# EAGLE design GPIO_adaptator (EAGLE 6.3)
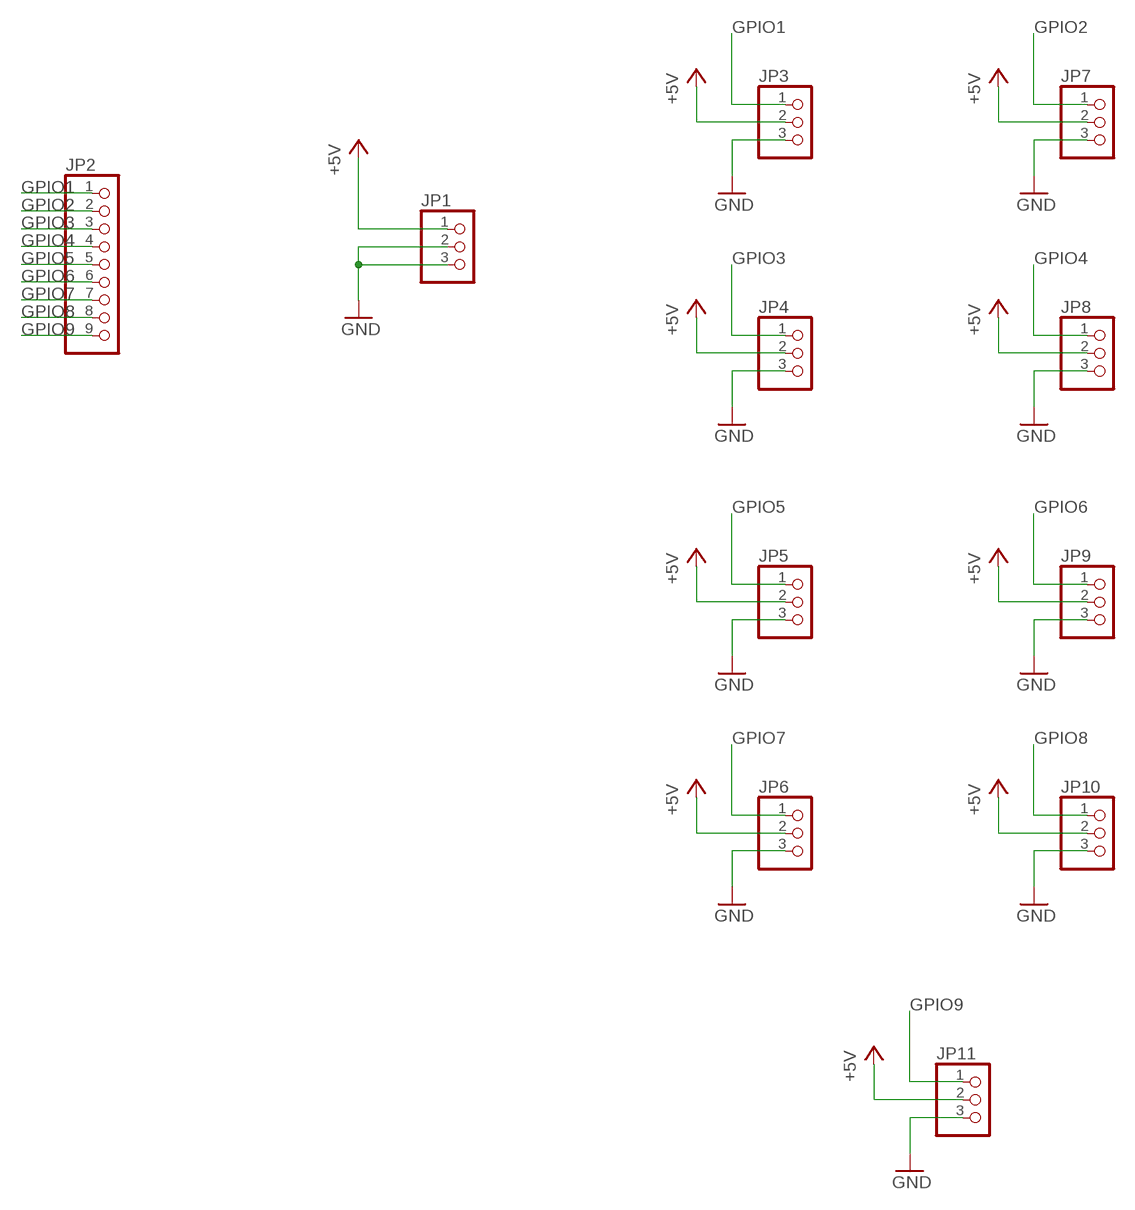
[diagram p0: schematic, sheet 1]

## Parts
JP1  PINHD-1X3  [1X03]
JP2  PINHD-1X9  [1X09]
JP3  PINHD-1X3  [1X03]
JP4  PINHD-1X3  [1X03]
JP5  PINHD-1X3  [1X03]
JP6  PINHD-1X3  [1X03]
JP7  PINHD-1X3  [1X03]
JP8  PINHD-1X3  [1X03]
JP9  PINHD-1X3  [1X03]
JP10  PINHD-1X3  [1X03]
JP11  PINHD-1X3  [1X03]

## Nets
+5V: JP1.1 JP3.2 JP4.2 JP5.2 JP6.2 JP7.2 JP8.2 JP9.2 JP10.2 JP11.2
GND: JP1.2 JP1.3 JP3.3 JP4.3 JP5.3 JP6.3 JP7.3 JP8.3 JP9.3 JP10.3 JP11.3
GPIO1: JP2.1 JP3.1
GPIO2: JP2.2 JP7.1
GPIO3: JP2.3 JP4.1
GPIO4: JP2.4 JP8.1
GPIO5: JP2.5 JP5.1
GPIO6: JP2.6 JP9.1
GPIO7: JP2.7 JP6.1
GPIO8: JP2.8 JP10.1
GPIO9: JP2.9 JP11.1

## Library data of the parts
JP1 JP3-JP11 = pinhead:PINHD-1X3: PIN HEADER
JP2 = pinhead:PINHD-1X9: PIN HEADER

## Board
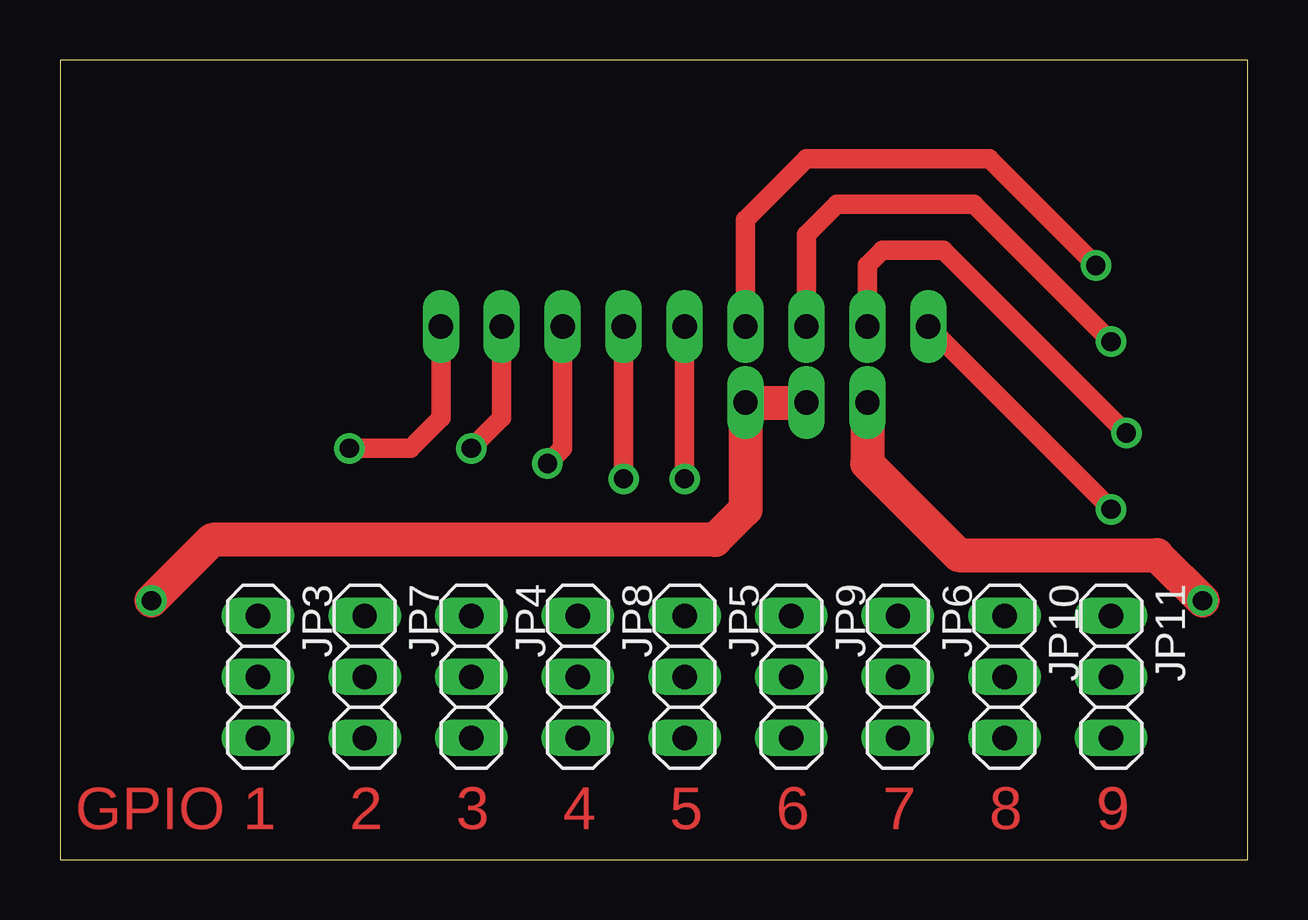
[diagram p1: board, top side]
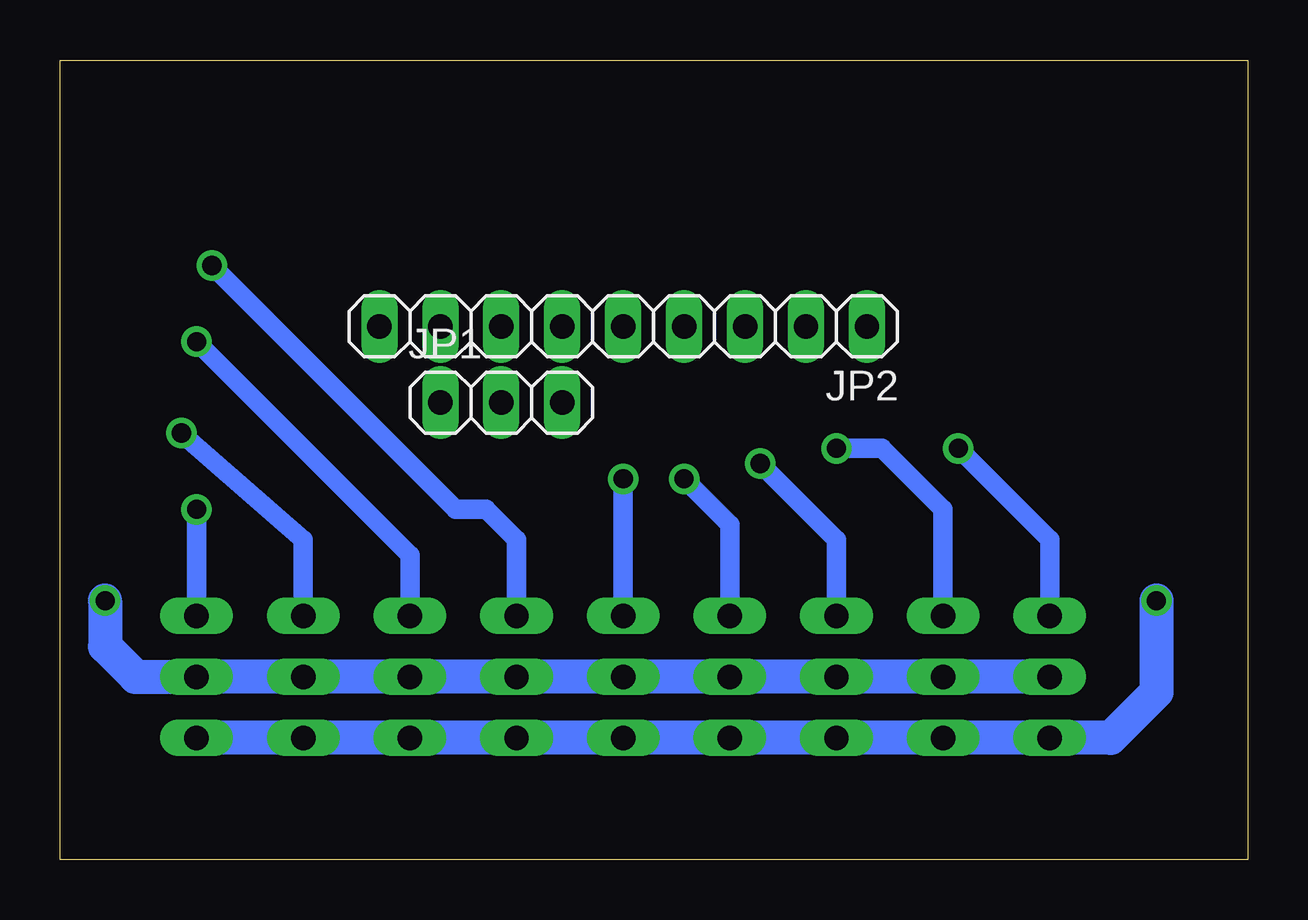
[diagram p2: board, bottom side, seen from below]

Size 49.51 x 33.33 mm. Coordinates in mm from the lower left corner, seen from the top.
Outline: 0,0 49.51,0 49.51,33.33 0,33.33 0,0
Copper layers (1*16): Top 0.035mm / dielectric 1.5mm / Bottom 0.035mm
Design rules "default": minimum track width 10mil, minimum drill 24mil, track to track 8mil, track to pad 8mil, pad to pad 8mil, via to via 8mil, smd to smd 8mil, copper to edge 40mil, drill to drill 8mil, minimum pad ring 10mil, minimum via ring 8mil, stop-mask expansion 4mil, vias tented up to drill 0mil, thermal gap 10mil

### Footprints (pad centres in the part's own frame; a part is rotated, then mirrored left to right if it is on the bottom)
1X03 = drill 1.016 long: 1 -2.54,0; 2 0,0; 3 2.54,0
1X09 = drill 1.016 long: 1 -10.16,0; 2 -7.62,0; 3 -5.08,0; 4 -2.54,0; 5 0,0; 6 2.54,0; 7 5.08,0; 8 7.62,0; 9 10.16,0

### Placement (x,y rotation side)
JP1  31.11,19.05 0 bottom
JP2  26.04,22.23 180 bottom
JP3  8.26,7.62 270 top
JP4  17.14,7.62 270 top
JP5  26.04,7.62 270 top
JP6  34.92,7.62 270 top
JP7  12.7,7.62 270 top
JP8  21.59,7.62 270 top
JP9  30.48,7.62 270 top
JP10  39.37,7.62 270 top
JP11  43.81,7.62 270 top

### Tracks (layer width: path | path; a pad name or v marks a point on that pad's centre or on a via)
+5V  (via drill 0.8 pad 1.27)
  Top 1.422: JP1.1 33.66,16.51 37.47,12.7 45.72,12.7 v47.62,10.79
  Bottom 1.422: JP3.2 JP7.2 JP4.2 JP8.2 JP5.2 JP9.2 JP6.2 JP10.2 JP11.2 46.35,7.62 47.62,8.89 v47.62,10.79
GND  (via drill 0.8 pad 1.27)
  Top 1.422: v3.81,10.79 6.35,13.34 27.3,13.34 28.57,14.61 JP1.3 JP1.2
  Bottom 1.422: JP11.3 JP10.3 JP6.3 JP9.3 JP5.3 JP8.3 JP4.3 JP7.3 JP3.3 5.71,5.08 3.81,6.99 v3.81,10.79
GPIO1  (via drill 0.8 pad 1.27)
  Top 0.813: JP2.1 15.88,18.41 14.61,17.14 v12.06,17.14
  Bottom 0.813: v12.06,17.14 8.26,13.34 JP3.1
GPIO2  (via drill 0.8 pad 1.27)
  Top 0.813: JP2.2 18.41,18.41 v17.14,17.14
  Bottom 0.813: v17.14,17.14 15.24,17.14 12.7,14.61 JP7.1
GPIO3  (via drill 0.8 pad 1.27)
  Top 0.813: JP2.3 20.95,17.14 v20.32,16.51
  Bottom 0.813: v20.32,16.51 17.14,13.34 JP4.1
GPIO4  (via drill 0.8 pad 1.27)
  Top 0.813: JP2.4 v23.5,15.88
  Bottom 0.813: v23.5,15.88 21.59,13.97 JP8.1
GPIO5  (via drill 0.8 pad 1.27)
  Top 0.813: JP2.5 v26.04,15.88
  Bottom 0.813: v26.04,15.88 JP5.1
GPIO6  (via drill 0.8 pad 1.27)
  Top 0.813: JP2.6 28.57,26.67 31.11,29.21 38.73,29.21 v43.18,24.77
  Bottom 0.813: v43.18,24.77 33.02,14.61 31.75,14.61 30.48,13.34 JP9.1
GPIO7  (via drill 0.8 pad 1.27)
  Top 0.813: JP2.7 31.11,26.04 32.38,27.3 38.1,27.3 v43.81,21.59
  Bottom 0.813: v43.81,21.59 34.92,12.7 JP6.1
GPIO8  (via drill 0.8 pad 1.27)
  Top 0.813: JP2.8 33.66,24.77 34.29,25.4 36.83,25.4 v44.45,17.78
  Bottom 0.813: v44.45,17.78 39.37,13.34 JP10.1
GPIO9  (via drill 0.8 pad 1.27)
  Top 0.813: JP2.9 v43.81,14.61
  Bottom 0.813: v43.81,14.61 JP11.1

### Text on the board
Top: GPIO | 1 | 2 | 3 | 4 | 5 | 6 | 7 | 8 | 9